# Altium schematic sheet Output_Expander_IC.SchDoc
size A4; SheetNumber: 29; SheetTotal: 29
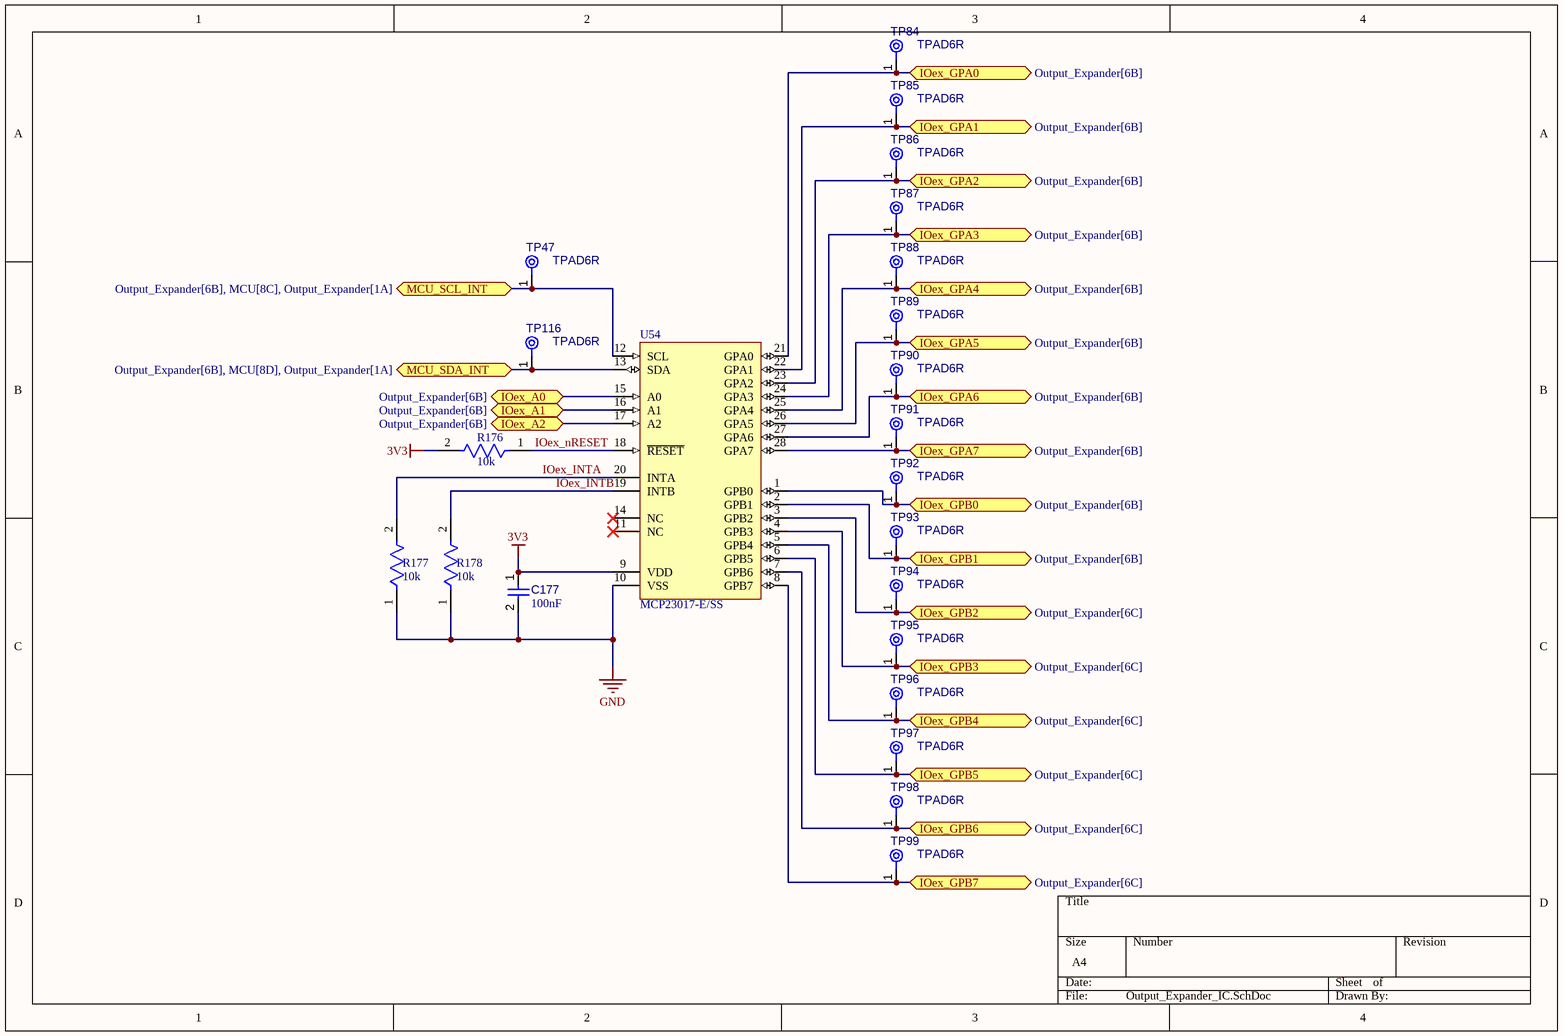
[diagram p0: Output_Expander_IC.SchDoc]

## Parts
C177  value 100nF  [CAPC1608X90X40NL10T20]  (hidden comment: Capacitor 100 nF +/-10% 50 V 0603)
R176  value 10k  [FP-RT0603-IPC_C]  (hidden comment: RT0603BRD0710KL)
R177  value 10k  [FP-RT0603-IPC_C]  (hidden comment: RT0603BRD0710KL)
R178  value 10k  [FP-RT0603-IPC_C]  (hidden comment: RT0603BRD0710KL)
TP47  TPAD6R  [TP06R]  (no BOM)
TP84  TPAD6R  [TP06R]  (no BOM)
TP85  TPAD6R  [TP06R]  (no BOM)
TP86  TPAD6R  [TP06R]  (no BOM)
TP87  TPAD6R  [TP06R]  (no BOM)
TP88  TPAD6R  [TP06R]  (no BOM)
TP89  TPAD6R  [TP06R]  (no BOM)
TP90  TPAD6R  [TP06R]  (no BOM)
TP91  TPAD6R  [TP06R]  (no BOM)
TP92  TPAD6R  [TP06R]  (no BOM)
TP93  TPAD6R  [TP06R]  (no BOM)
TP94  TPAD6R  [TP06R]  (no BOM)
TP95  TPAD6R  [TP06R]  (no BOM)
TP96  TPAD6R  [TP06R]  (no BOM)
TP97  TPAD6R  [TP06R]  (no BOM)
TP98  TPAD6R  [TP06R]  (no BOM)
TP99  TPAD6R  [TP06R]  (no BOM)
TP116  TPAD6R  [TP06R]  (no BOM)
U54  MCP23017-E/SS  [SSOP-SS28_M]

## Ports
IOex_A0 (bidir, see Output_Expander[6B]), IOex_A1 (bidir, see Output_Expander[6B]), IOex_A2 (bidir, see Output_Expander[6B]), IOex_GPA0 (bidir, see Output_Expander[6B]), IOex_GPA1 (bidir, see Output_Expander[6B]), IOex_GPA2 (bidir, see Output_Expander[6B]), IOex_GPA3 (bidir, see Output_Expander[6B]), IOex_GPA4 (bidir, see Output_Expander[6B]), IOex_GPA5 (bidir, see Output_Expander[6B]), IOex_GPA6 (bidir, see Output_Expander[6B]), IOex_GPA7 (bidir, see Output_Expander[6B]), IOex_GPB0 (bidir, see Output_Expander[6B]), IOex_GPB1 (bidir, see Output_Expander[6B]), IOex_GPB2 (bidir, see Output_Expander[6C]), IOex_GPB3 (bidir, see Output_Expander[6C]), IOex_GPB4 (bidir, see Output_Expander[6C]), IOex_GPB5 (bidir, see Output_Expander[6C]), IOex_GPB6 (bidir, see Output_Expander[6C]), IOex_GPB7 (bidir, see Output_Expander[6C]), MCU_SCL_INT (bidir, see Output_Expander[6B], MCU[8C], Output_Expander[1A]), MCU_SDA_INT (bidir, see Output_Expander[6B], MCU[8D], Output_Expander[1A])

## Nets
3V3: C177.1 R176.2 U54.9(VDD)
GND: C177.2 R177.1 R178.1 U54.10(VSS)
IOex_A0: U54.15(A0) ; port IOex_A0
IOex_A1: U54.16(A1) ; port IOex_A1
IOex_A2: U54.17(A2) ; port IOex_A2
IOex_GPA0: TP84.1(TP) U54.21(GPA0) ; port IOex_GPA0
IOex_GPA1: TP85.1(TP) U54.22(GPA1) ; port IOex_GPA1
IOex_GPA2: TP86.1(TP) U54.23(GPA2) ; port IOex_GPA2
IOex_GPA3: TP87.1(TP) U54.24(GPA3) ; port IOex_GPA3
IOex_GPA4: TP88.1(TP) U54.25(GPA4) ; port IOex_GPA4
IOex_GPA5: TP89.1(TP) U54.26(GPA5) ; port IOex_GPA5
IOex_GPA6: TP90.1(TP) U54.27(GPA6) ; port IOex_GPA6
IOex_GPA7: TP91.1(TP) U54.28(GPA7) ; port IOex_GPA7
IOex_GPB0: TP92.1(TP) U54.1(GPB0) ; port IOex_GPB0
IOex_GPB1: TP93.1(TP) U54.2(GPB1) ; port IOex_GPB1
IOex_GPB2: TP94.1(TP) U54.3(GPB2) ; port IOex_GPB2
IOex_GPB3: TP95.1(TP) U54.4(GPB3) ; port IOex_GPB3
IOex_GPB4: TP96.1(TP) U54.5(GPB4) ; port IOex_GPB4
IOex_GPB5: TP97.1(TP) U54.6(GPB5) ; port IOex_GPB5
IOex_GPB6: TP98.1(TP) U54.7(GPB6) ; port IOex_GPB6
IOex_GPB7: TP99.1(TP) U54.8(GPB7) ; port IOex_GPB7
IOex_INTA: R177.2 U54.20(INTA)
IOex_INTB: R178.2 U54.19(INTB)
IOex_nRESET: R176.1 U54.18(~{RESET})
MCU_SCL_INT: TP47.1(TP) U54.12(SCL) ; port MCU_SCL_INT
MCU_SDA_INT: TP116.1(TP) U54.13(SDA) ; port MCU_SDA_INT

Not connected (* = marked no-connect by the designer): U54 11(NC)* 14(NC)*

## Library data of the parts
C177 = CMP-001-00017-6: Chip Capacitor, 100 nF, +/- 10%, 50 V, 0603 (1608 Metric); Voltage Rating: 50V; Capacitor Type: Ceramic; Tolerance: 10%; Mounting Technology: SM; Max Operating Temperature: 125°C; RoHS Compliant: True; Pins: 2; Case/Package: 0603; Min Operating Temperature: -55°C
R176-R178 = CMP-009-00322-1: Res Thin Film 0603 10K Ohm 0.1% 1/10W |25ppm/|C SMD Paper T/R; Voltage Rating: 75V; Max Power Dissipation: 100mW; Temperature Coefficient: 25ppm/°C; Min Operating Temperature: -55°C; Case/Package: 0603; Mounting Technology: Surface Mount; Max Operating Temperature: 155°C; Tolerance: 0.1%; Case Code (Imperial): 0603; China RoHS: Non-Compliant; Composition: Thin Film; Country of Origin: Mainland China, Taiwan; Depth: 800µm; Export Control Classification Number (ECCN) Code: EAR99; Features: Moisture Resistant; Harmonized Tariff Schedule (HTS) Code: 8533.21.00.30; Height: 450µm; Introduction Date: 2008-06-09; Lead Free: Lead Free; Length: 1.6mm; Lifecycle Status: Production; Military Standard: Not; Number of Terminals: 2; Number of Terminations: 2; Power Rating: 100mW; REACH SVHC: Yes; RoHS: Compliant; Schedule B: 8533210045, 8533210045; Termination: SMD/SMT; Voltage Rating (DC): 75V; Weight: 2.012816mg; Width: 800µm; Working Voltage: 75V
TP47 TP84-TP99 TP116 = CMP-00028-00002-2: 0.6mm round; Pins: 1
U54 = CMP-031-00018-1: I²C Bus IC Operating temperature: -40...+125 °C Power supply: 1.8...5.5 V Package: SSOP-20; Manufacturer Lifecycle Status: REL; Number of I/Os: 16; Interface: I2C, Serial; Frequency: 1.7MHz; Max Supply Voltage: 5.5V; Max Power Dissipation: 700mW; Output Current: 25mA; Min Supply Voltage: 4.5V; Nominal Supply Current: 1mA; Projected EOL Date: 2034-06-24; Schedule B: 8542390000, 8542390000; Mounting Technology: Surface Mount; Packaging: Bulk; RoHS: Compliant; Case/Package: SSOP; Lead Free: Lead Free; HS Code: 8542.39.0090; Country of Fabrication: United States of America; Introduction Date: 2005-06-24; Export Control Classification Number (ECCN) Code: EAR99; Lifecycle Status: Production; Country of Origin: Philippines, Thailand; Pins: 28; Number of Bits: 16; Clock Frequency: 1.7MHz; Min Operating Temperature: -40°C; Max Operating Temperature: 125°C; Weight: 2.26799g; Harmonized Tariff Schedule (HTS) Code: 8542.39.0060; Country of Assembly: Philippines, Thailand; REACH SVHC: No